# Altium schematic sheet МПСУ.464421.22-01 RF_OUT.SchDoc
size 420 x 297 mm; Address1: Address1; Address2: Address2; Address3: Address3; Address4: Address4; SheetNumber: 3; SheetTotal: 6; DocumentTypeSCH: Э3; DocumentName1SCH: Плата; NachOtdelaSCH: Орешкин; UtverjdenSCH: Утвержден
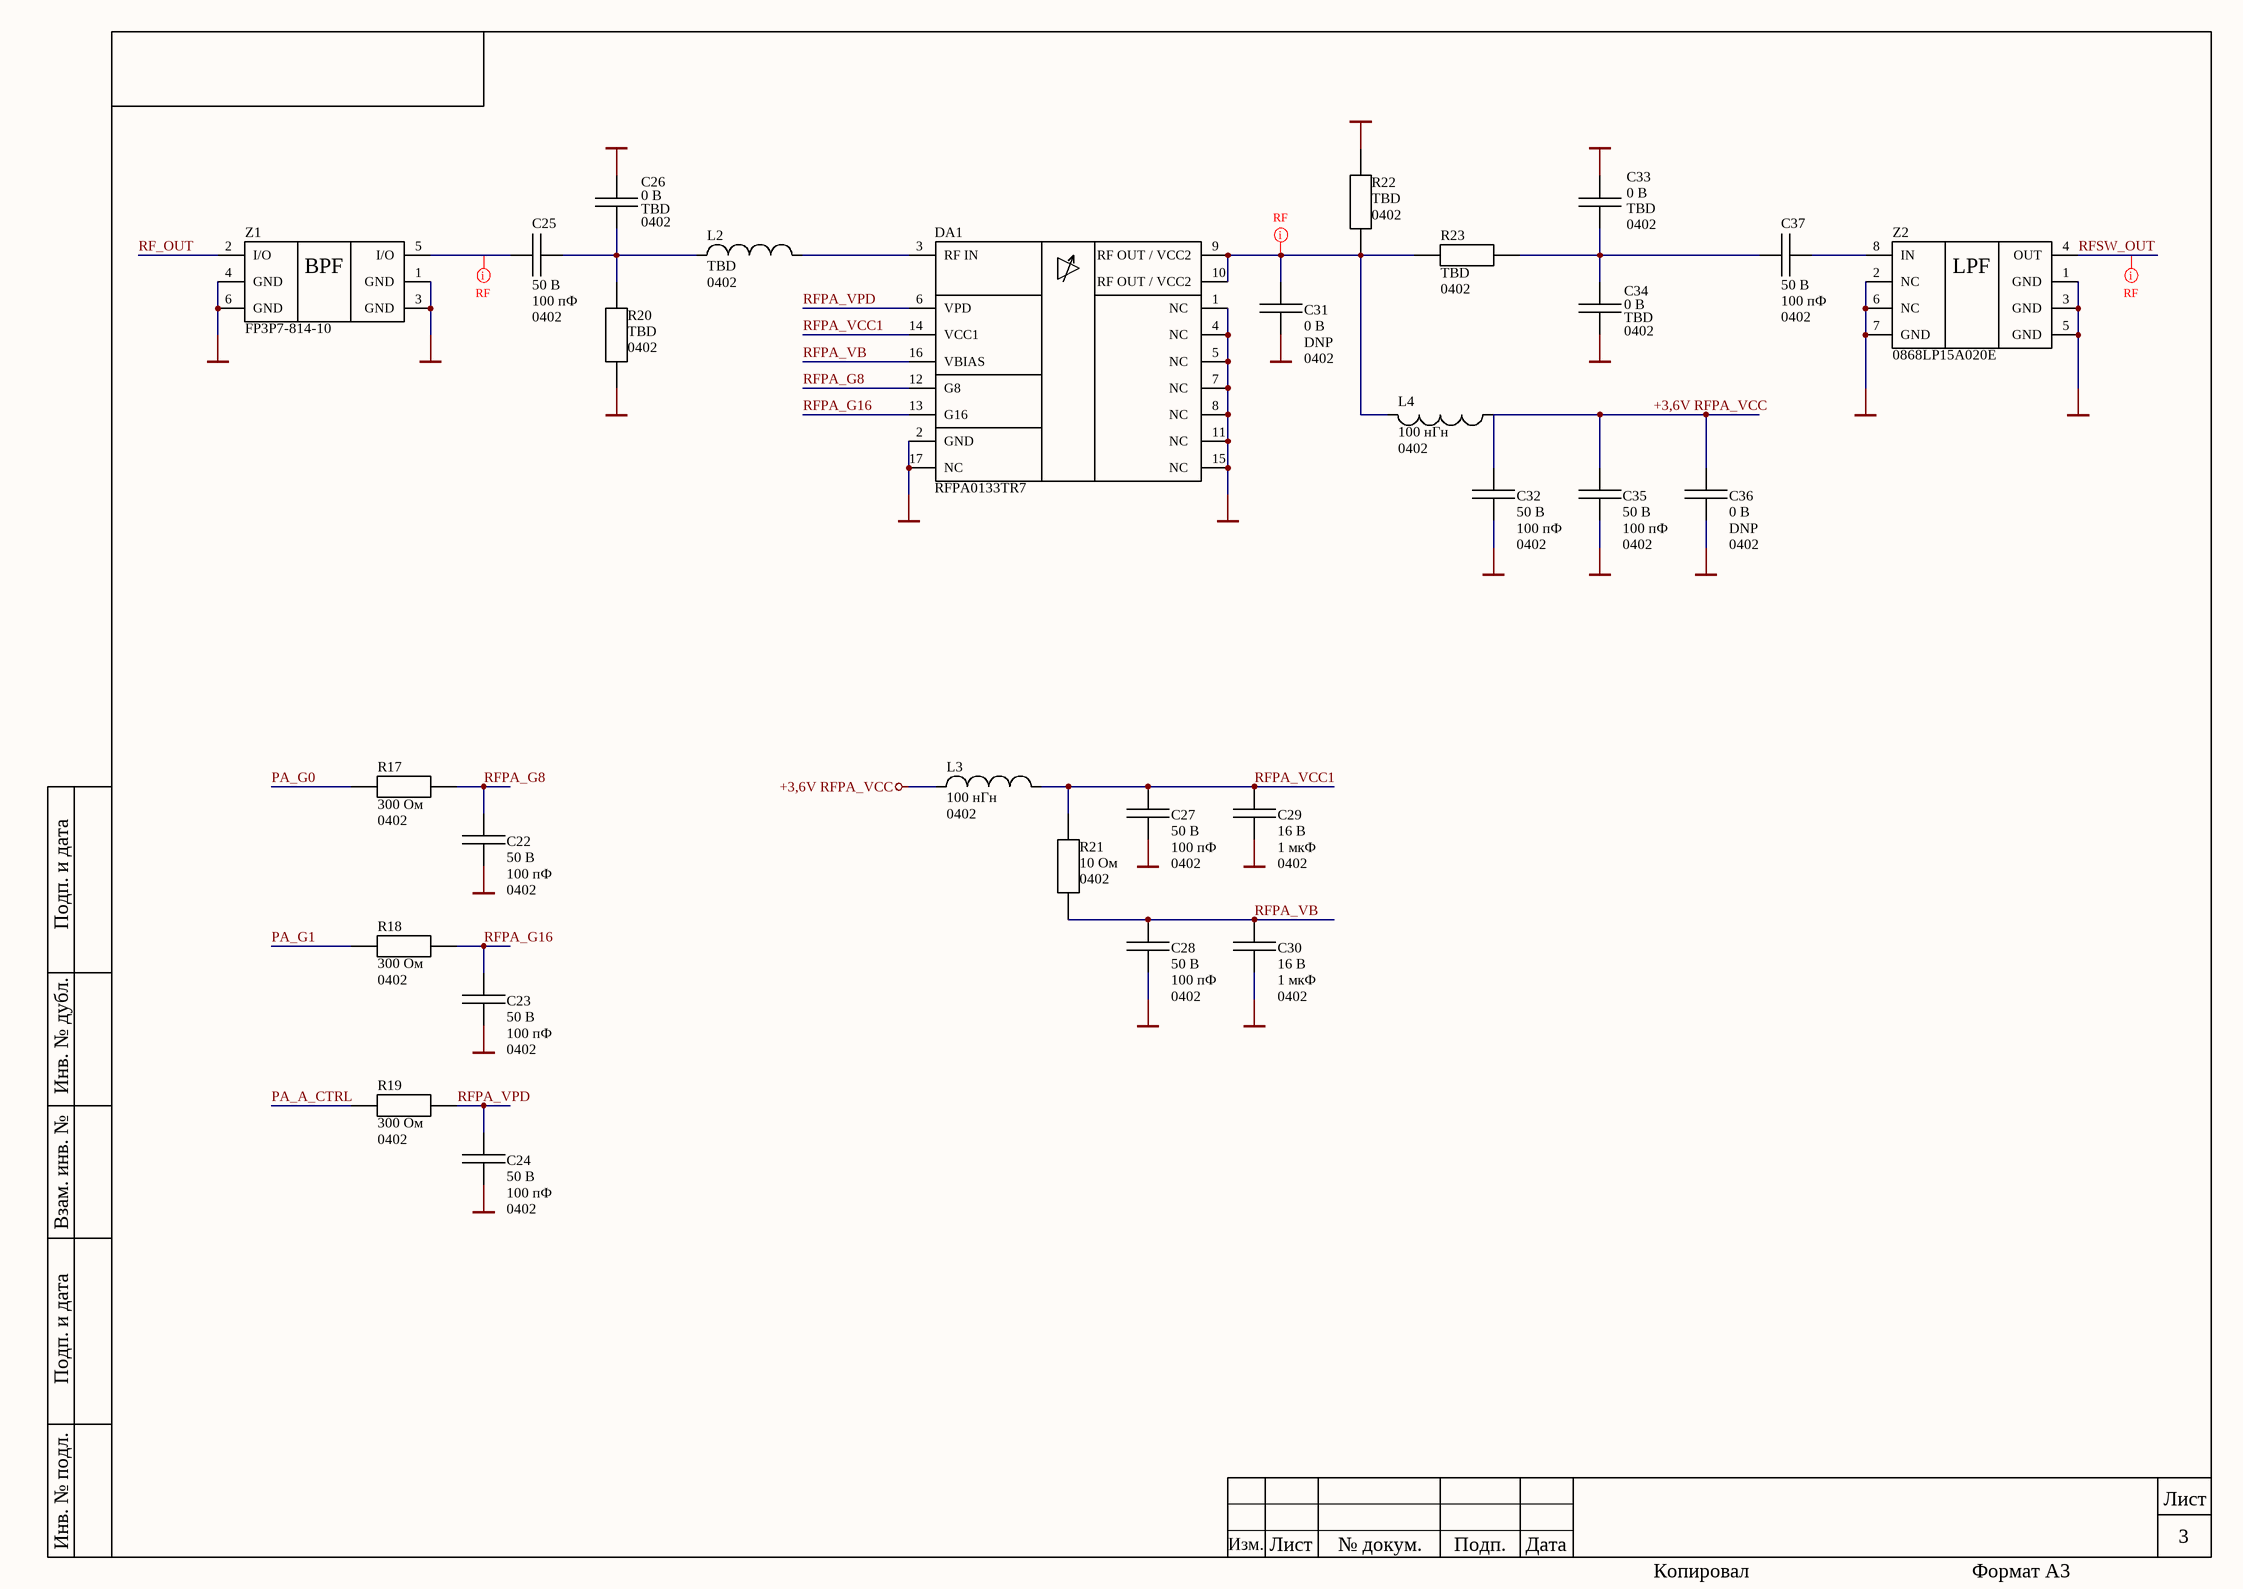
[diagram p0: МПСУ.464421.22-01 RF_OUT.SchDoc]

## Parts
C22  value 100 пФ  Peak_Condition: 50 В  Package: 0402  [CAPC100X50X55L20N]  (hidden comment: 100 пФ ± 5 % 50 В C0G 0402 GRM1555C1H101JZ01D)
C23  value 100 пФ  Peak_Condition: 50 В  Package: 0402  [CAPC100X50X55L20N]  (hidden comment: 100 пФ ± 5 % 50 В C0G 0402 GRM1555C1H101JZ01D)
C24  value 100 пФ  Peak_Condition: 50 В  Package: 0402  [CAPC100X50X55L20N]  (hidden comment: 100 пФ ± 5 % 50 В C0G 0402 GRM1555C1H101JZ01D)
C25  value 100 пФ  Peak_Condition: 50 В  Package: 0402  [CAPC100X50X55L20N]  (hidden comment: 100 пФ ± 5 % 50 В C0G 0402 GRM1555C1H101JZ01D)
C26  value TBD  Peak_Condition: 0 В  Package: 0402  [CAPC100X50X55L20N]  (hidden comment: TBD 0402)
C27  value 100 пФ  Peak_Condition: 50 В  Package: 0402  [CAPC100X50X55L20N]  (hidden comment: 100 пФ ± 5 % 50 В C0G 0402 GRM1555C1H101JZ01D)
C28  value 100 пФ  Peak_Condition: 50 В  Package: 0402  [CAPC100X50X55L20N]  (hidden comment: 100 пФ ± 5 % 50 В C0G 0402 GRM1555C1H101JZ01D)
C29  value 1 мкФ  Peak_Condition: 16 В  Package: 0402  [CAPC100X50X55L20N]  (hidden comment: 1 мкФ ± 10 % 16 В X5R 0402 GRM155R61C105KA12D)
C30  value 1 мкФ  Peak_Condition: 16 В  Package: 0402  [CAPC100X50X55L20N]  (hidden comment: 1 мкФ ± 10 % 16 В X5R 0402 GRM155R61C105KA12D)
C31  value DNP  Peak_Condition: 0 В  Package: 0402  [CAPC100X50X55L20N]  (hidden comment: DNP 0402)
C32  value 100 пФ  Peak_Condition: 50 В  Package: 0402  [CAPC100X50X55L20N]  (hidden comment: 100 пФ ± 5 % 50 В C0G 0402 GRM1555C1H101JZ01D)
C33  value TBD  Peak_Condition: 0 В  Package: 0402  [CAPC100X50X55L20N]  (hidden comment: TBD 0402)
C34  value TBD  Peak_Condition: 0 В  Package: 0402  [CAPC100X50X55L20N]  (hidden comment: TBD 0402)
C35  value 100 пФ  Peak_Condition: 50 В  Package: 0402  [CAPC100X50X55L20N]  (hidden comment: 100 пФ ± 5 % 50 В C0G 0402 GRM1555C1H101JZ01D)
C36  value DNP  Peak_Condition: 0 В  Package: 0402  [CAPC100X50X55L20N]  (hidden comment: DNP 0402)
C37  value 100 пФ  Peak_Condition: 50 В  Package: 0402  [CAPC100X50X55L20N]  (hidden comment: 100 пФ ± 5 % 50 В C0G 0402 GRM1555C1H101JZ01D)
DA1  RFPA0133TR7  [QFN50P300X300X90_HS-17N]
L2  value TBD  Package: 0402  [INDC100X50X60L10N]  (hidden comment: TBD 0402)
L3  value 100 нГн  Package: 0402  [INDC100X50X60L10N]  (hidden comment: 100 нГн ± 5 % 200 мА 0402 LQG15HNR10J02D)
L4  value 100 нГн  Package: 0402  [INDC100X50X60L10N]  (hidden comment: 100 нГн ± 5 % 200 мА 0402 LQG15HNR10J02D)
R17  value 300 Ом  Package: 0402  [RESC100X50X40L25N]  (hidden comment: 300 Ом ± 5 % 0 Вт 0402 RI0402L301JT)
R18  value 300 Ом  Package: 0402  [RESC100X50X40L25N]  (hidden comment: 300 Ом ± 5 % 0 Вт 0402 RI0402L301JT)
R19  value 300 Ом  Package: 0402  [RESC100X50X40L25N]  (hidden comment: 300 Ом ± 5 % 0 Вт 0402 RI0402L301JT)
R20  value TBD  Package: 0402  [RESC100X50X40L25N]  (hidden comment: TBD 0402)
R21  value 10 Ом  Package: 0402  [RESC100X50X40L25N]  (hidden comment: 10 Ом ± 5 % 0 Вт 0402 RI0402L100JT)
R22  value TBD  Package: 0402  [RESC100X50X40L25N]  (hidden comment: TBD 0402)
R23  value TBD  Package: 0402  [RESC100X50X40L25N]  (hidden comment: TBD 0402)
Z1  FP3P7-814-10  [LCCS110P300X300X146-6N]
Z2  0868LP15A020E  [LCC065P125X200X085-8]

## Nets
+3,6V RFPA_VCC: C32.1 C35.1 C36.1 L3.1 L4.1
GND: C22.1 C23.1 C24.1 C26.2 C27.1 C28.1 C29.1 C30.1 C31.2 C32.2 C33.2 C34.2 C35.2 C36.2 DA1.1(NC) DA1.2(GND) DA1.4(NC) DA1.5(NC) DA1.7(NC) DA1.8(NC) DA1.11(NC) DA1.15(NC) DA1.17(NC) R20.2 R22.2 Z1.1(GND) Z1.3(GND) Z1.4(GND) Z1.6(GND) Z2.1(GND) Z2.2(NC) Z2.3(GND) Z2.5(GND) Z2.6(NC) Z2.7(GND)
PA_A_CTRL: R19.1
PA_G0: R17.1
PA_G1: R18.1
RF_OUT: Z1.2(I/O)
RFPA_G8: C22.2 DA1.12(G8) R17.2
RFPA_G16: C23.2 DA1.13(G16) R18.2
RFPA_VB: C28.2 C30.2 DA1.16(VBIAS) R21.2
RFPA_VPD: C24.2 DA1.6(VPD) R19.2
RFPA_VСС1: C27.2 C29.2 DA1.14(VCC1) L3.2 R21.1
RFSW_OUT: Z2.4(OUT)
NetC25_1: C25.1 Z1.5(I/O)
NetC25_2: C25.2 C26.1 L2.1 R20.1
NetC31_1: C31.1 DA1.9(RF_OUT_/_VCC2) DA1.10(RF_OUT_/_VCC2) L4.2 R22.1 R23.1
NetC33_1: C33.1 C34.1 C37.1 R23.2
NetC37_2: C37.2 Z2.8(IN)
NetDA1_3: DA1.3(RF_IN) L2.2

## Layout directives
net class RF: NetC25_1, NetC31_1, RFSW_OUT

## Notes on the sheet
- Подп. и дата
- Инв. № дубл.
- Взам. инв. №
- Инв. № подл.
- Изм.
- Лист
- № докум.
- Подп.
- Дата
- Копировал
- Формат А3
- (in symbol 0868LP15A020) LPF
- (in symbol FP3P7-***-**) BPF

## Library data of the parts
C22-C25 C27 C28 C32 C35 C37 = C 0402: Capacitor 0402; Manufacturer: Murata; Tolerance: 5 %; Designer: Свидерский; 3D_Body: +; PartNumber: GRM1555C1H101JZ01D; Category: Passive; Subcategory: Capacitor; Dielectric: C0G; Status: Approved
C26 C31 C33 C34 C36 = C 0402: Capacitor 0402; Tolerance: 0 %; Designer: Свидерский; Notes: CP; 3D_Body: +; Category: Passive; Subcategory: Capacitor; Status: Approved
C29 C30 = C 0402: Capacitor 0402; Manufacturer: Murata; Tolerance: 10 %; Designer: Свидерский; 3D_Body: +; PartNumber: GRM155R61C105KA12D; Category: Passive; Subcategory: Capacitor; Dielectric: X5R; Status: Approved
DA1 = RFPA0133TR7: 380 to 960 MHz, 3 to 5V programmable gain high efficiency power amplifier; Manufacturer: RFD, Qorvo; Designer: Лазба; 3D_Body: +; ComponentLink1Description: Техническое описание; ComponentLink1URL: Q:\Libs\Descriptions_PDF\RFPA0133_data_sheet.pdf; Category: IC; Subcategory: VGA; Status: Check; Package: 16-Lead QFN; PartNumber: RFPA0133TR7
L2 = L 0402: Inductor 0402; Designer: Свидерский; Notes: CP; 3D_Body: +; Tolerance: 0 %; Peak_Condition: 0 А; Category: Passive; Subcategory: Inductor; Status: Approved
L3 L4 = L 0402: Inductor 0402; Manufacturer: Murata; Designer: Свидерский; 3D_Body: +; Tolerance: 5 %; Peak_Condition: 200 мА; PartNumber: LQG15HNR10J02D; Category: Passive; Subcategory: Inductor; Status: Approved
R17-R19 R21 = R 0402: Resistor 0402; Manufacturer: Hottech; Designer: Свидерский; 3D_Body: +; Tolerance: 5 %; Peak_Condition: 0 Вт; Category: Passive; Subcategory: Resistor; Status: Approved
  R17-R19: PartNumber: RI0402L301JT
  R21: PartNumber: RI0402L100JT
R20 R22 R23 = R 0402: Resistor 0402; Designer: Свидерский; Notes: CP; 3D_Body: +; Tolerance: 0 %; Peak_Condition: 0 Вт; Category: Passive; Subcategory: Resistor; Status: Approved
Z1 = FP3P7-***-**: BandPass Filter; Manufacturer: БУТИС; Designer: Лазба; 3D_Body: +; ComponentLink1Description: Техническое описание; ComponentLink1URL: Q:\Libs\Descriptions_PDF\FP3P7-814-10.pdf; Category: Passive; Subcategory: Filter; Status: Check; Package: SMD 3,0x3,0; PartNumber: FP3P7-814-10
Z2 = 0868LP15A020: 868MHz Center Frequency Low Pass Filter for high frequency ceramic solutions 20MHz Bandwidth 0.5dB 0805 (2012 Metric), 8 PC Pad; Manufacturer: Johanson Technology Inc.; Designer: Лазба; 3D_Body: +; ComponentLink1Description: Техническое описание; ComponentLink1URL: Q:\Libs\Descriptions_PDF\0868LP15A020.pdf; Category: Passive; Subcategory: Filter; Status: Check; PartNumber: 0868LP15A020E